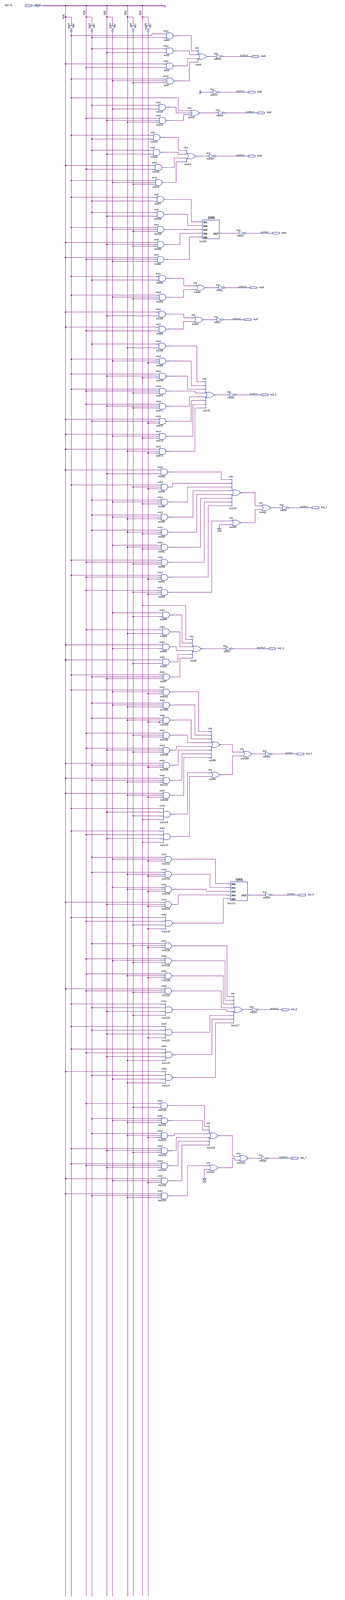
[diagram p0: schematic sheet, whole]
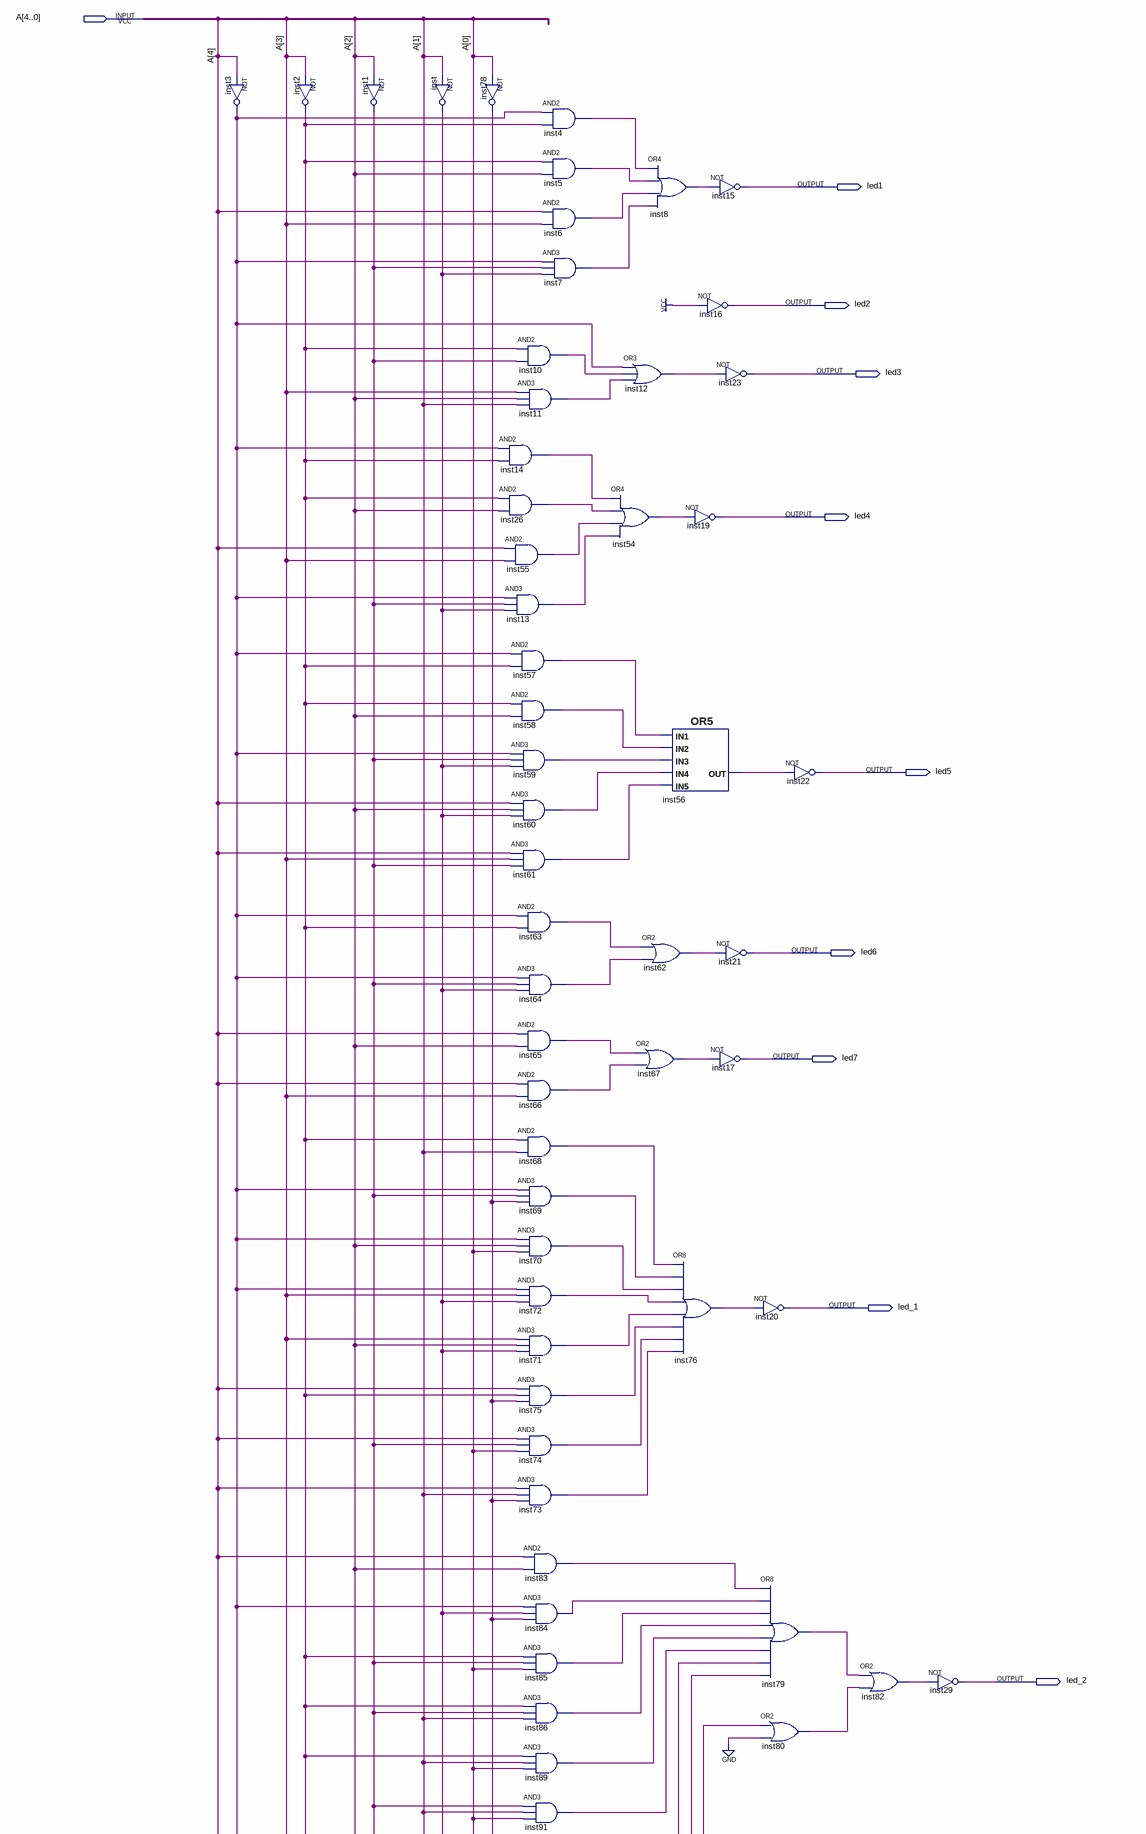
[diagram p1: schematic sheet, upper part]
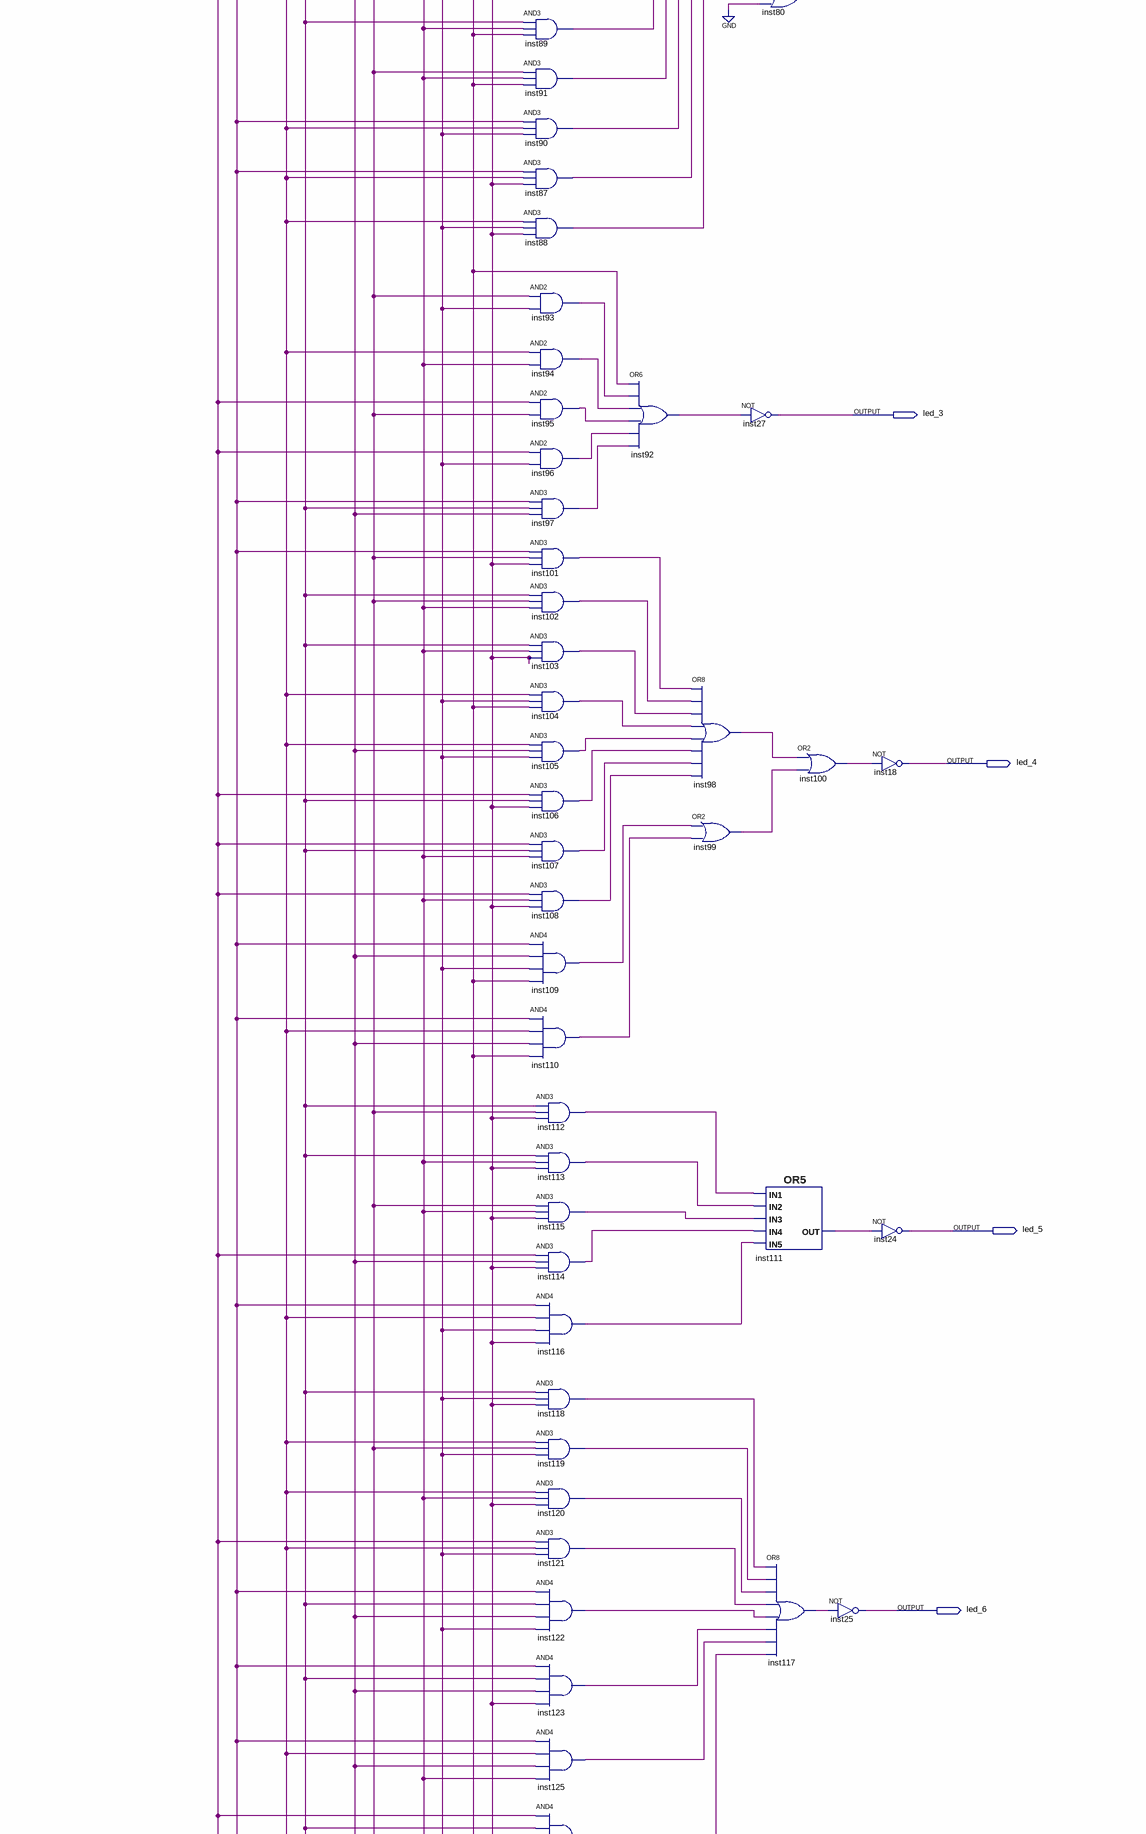
[diagram p2: schematic sheet, middle part]
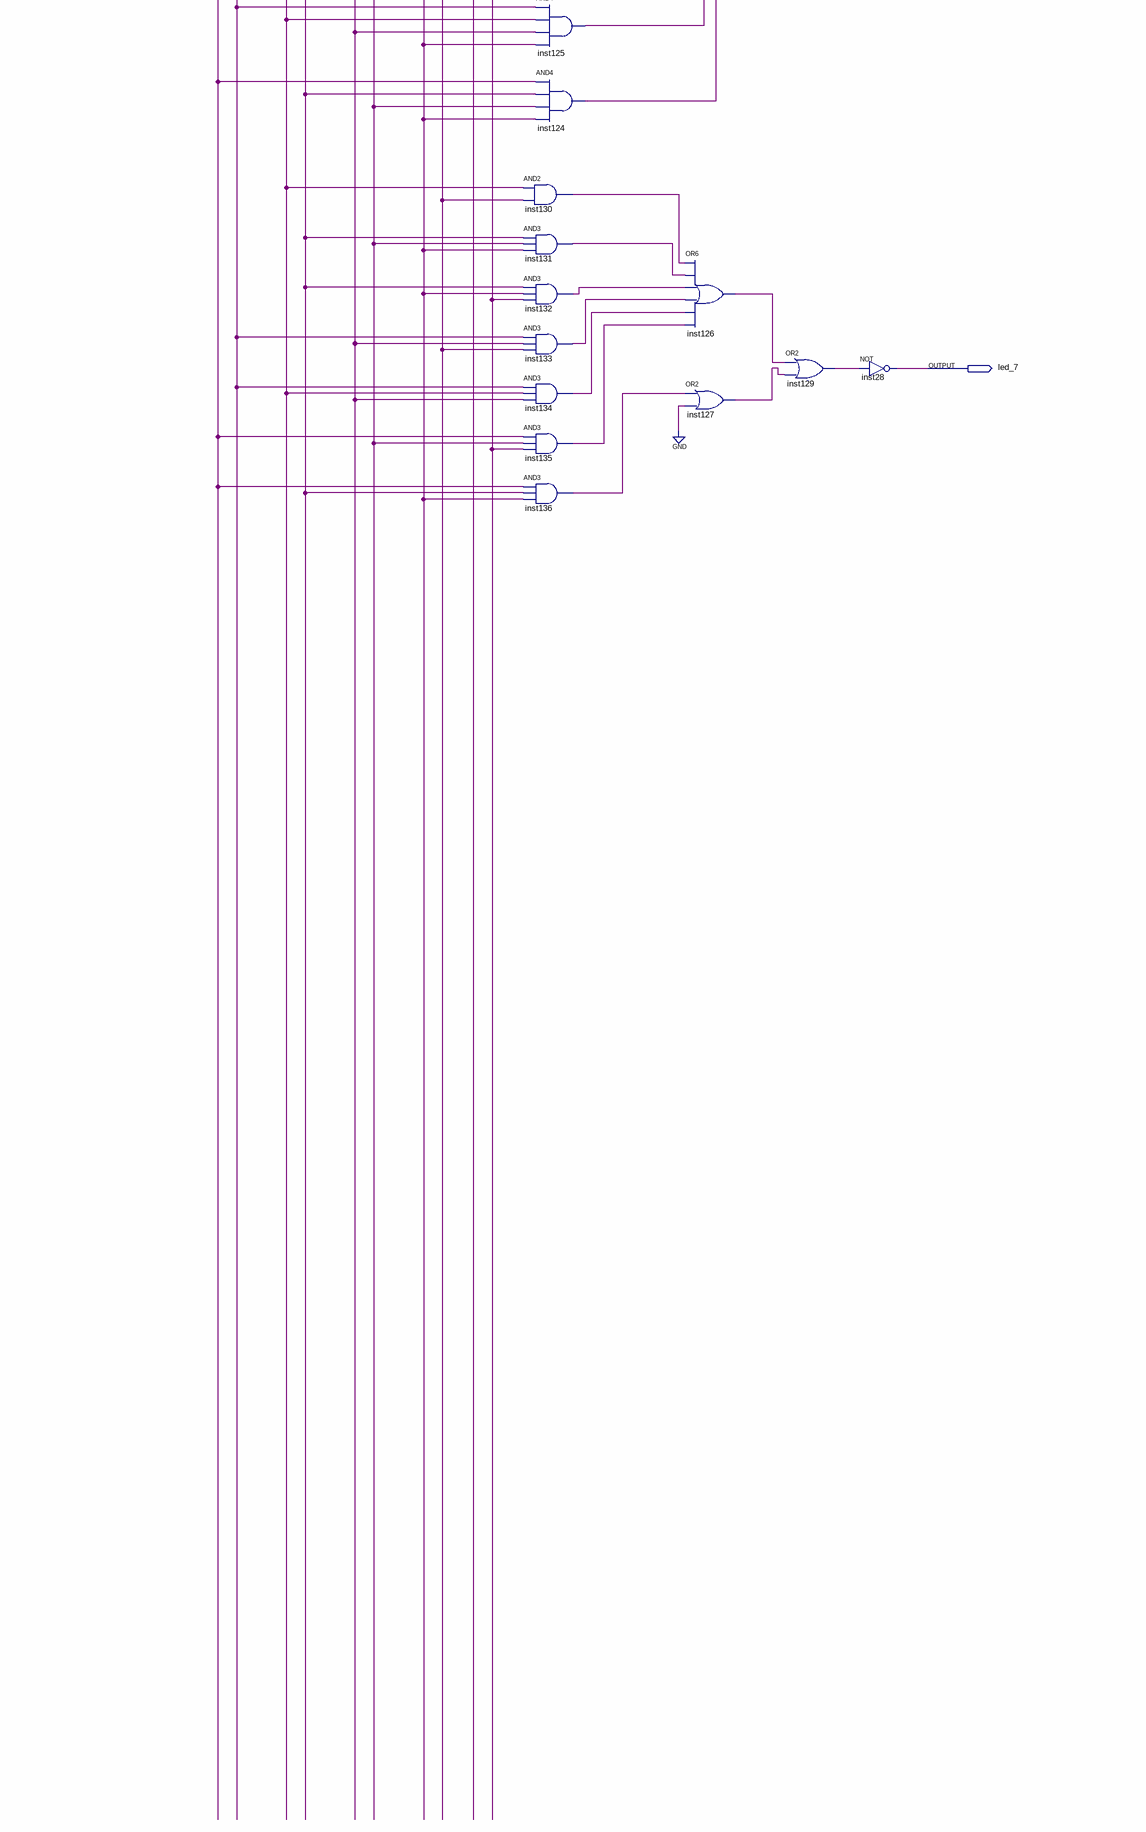
[diagram p3: schematic sheet, lower part]
// Quartus schematic decodificador5bits.bdf as structural Verilog: 109 symbols, 15 pins
module decodificador5bits (
  input  [4:0] A,
  output led1,
  output led2,
  output led3,
  output led4,
  output led5,
  output led6,
  output led7,
  output led_1,
  output led_2,
  output led_3,
  output led_4,
  output led_5,
  output led_6,
  output led_7
);

  wire inst1_out, inst2_out, inst3_out, inst4_out, inst5_out, inst6_out, inst7_out, inst8_out, inst10_out,
       inst11_out, inst12_out, inst13_out, inst14_out, inst26_out, inst54_out, inst55_out, inst56_out,
       inst57_out, inst58_out, inst59_out, inst60_out, inst61_out, inst62_out, inst63_out, inst64_out,
       inst65_out, inst66_out, inst67_out, inst68_out, inst69_out, inst70_out, inst71_out, inst72_out,
       inst73_out, inst74_out, inst75_out, inst76_out, inst78_out, inst79_out, inst80_out, inst82_out,
       inst83_out, inst84_out, inst85_out, inst86_out, inst87_out, inst88_out, inst89_out, inst90_out,
       inst91_out, inst92_out, inst93_out, inst94_out, inst95_out, inst96_out, inst97_out, inst98_out,
       inst99_out, inst100_out, inst101_out, inst102_out, inst103_out, inst104_out, inst105_out, inst106_out,
       inst107_out, inst108_out, inst109_out, inst110_out, inst111_out, inst112_out, inst113_out,
       inst114_out, inst115_out, inst116_out, inst117_out, inst118_out, inst119_out, inst120_out,
       inst121_out, inst122_out, inst123_out, inst124_out, inst125_out, inst126_out, inst127_out,
       inst129_out, inst130_out, inst131_out, inst132_out, inst133_out, inst134_out, inst135_out,
       inst136_out, inst_out;

  not inst3 (inst3_out, A[4]);
  not inst2 (inst2_out, A[3]);
  not inst1 (inst1_out, A[2]);
  not inst (inst_out, A[1]);
  not inst78 (inst78_out, A[0]);
  and inst14 (inst14_out, inst3_out, inst2_out);
  and inst26 (inst26_out, inst2_out, A[2]);
  and inst55 (inst55_out, A[4], A[3]);
  and inst13 (inst13_out, inst3_out, inst1_out, inst_out);
  and inst57 (inst57_out, inst3_out, inst2_out);
  and inst58 (inst58_out, inst2_out, A[2]);
  and inst59 (inst59_out, inst3_out, inst1_out, inst_out);
  and inst60 (inst60_out, A[4], A[2], inst_out);
  and inst61 (inst61_out, A[4], A[3], inst1_out);
  and inst4 (inst4_out, inst3_out, inst2_out);
  and inst5 (inst5_out, inst2_out, A[2]);
  and inst6 (inst6_out, A[4], A[3]);
  and inst7 (inst7_out, inst3_out, inst1_out, inst_out);
  and inst10 (inst10_out, inst2_out, inst1_out);
  and inst11 (inst11_out, A[3], A[2], A[1]);
  and inst63 (inst63_out, inst3_out, inst2_out);
  and inst64 (inst64_out, inst3_out, inst1_out, inst_out);
  and inst65 (inst65_out, A[4], A[2]);
  and inst66 (inst66_out, A[4], A[3]);
  and inst68 (inst68_out, inst2_out, A[1]);
  and inst69 (inst69_out, inst3_out, inst1_out, inst78_out);
  and inst70 (inst70_out, inst3_out, A[2], A[0]);
  and inst72 (inst72_out, inst3_out, A[3], inst_out);
  and inst71 (inst71_out, A[3], A[2], inst_out);
  and inst75 (inst75_out, A[4], inst2_out, inst78_out);
  and inst74 (inst74_out, A[4], inst1_out, A[0]);
  and inst73 (inst73_out, A[4], A[1], inst78_out);
  and inst83 (inst83_out, A[4], A[2]);
  and inst84 (inst84_out, inst3_out, inst_out, inst78_out);
  and inst85 (inst85_out, inst2_out, inst1_out, A[0]);
  and inst86 (inst86_out, inst2_out, inst1_out, A[1]);
  and inst89 (inst89_out, inst2_out, A[1], A[0]);
  and inst91 (inst91_out, inst1_out, A[1], A[0]);
  and inst90 (inst90_out, inst3_out, A[3], inst_out);
  and inst87 (inst87_out, inst3_out, A[3], inst78_out);
  and inst88 (inst88_out, A[3], inst_out, inst78_out);
  and inst93 (inst93_out, inst1_out, inst_out);
  and inst94 (inst94_out, A[3], A[1]);
  and inst95 (inst95_out, A[4], inst1_out);
  and inst96 (inst96_out, A[4], inst_out);
  and inst97 (inst97_out, inst3_out, inst2_out, A[2]);
  and inst101 (inst101_out, inst3_out, inst1_out, inst78_out);
  and inst102 (inst102_out, inst2_out, inst1_out, A[1]);
  and inst103 (inst103_out, inst2_out, A[1], inst78_out);
  and inst104 (inst104_out, A[3], inst_out, A[0]);
  and inst105 (inst105_out, A[3], A[2], inst_out);
  and inst106 (inst106_out, A[4], inst2_out, inst78_out);
  and inst107 (inst107_out, A[4], inst2_out, A[1]);
  and inst108 (inst108_out, A[4], A[1], inst78_out);
  and inst109 (inst109_out, inst3_out, A[2], inst_out, A[0]);
  and inst110 (inst110_out, inst3_out, A[3], A[2], A[0]);
  and inst112 (inst112_out, inst2_out, inst1_out, inst78_out);
  and inst113 (inst113_out, inst2_out, A[1], inst78_out);
  and inst115 (inst115_out, inst1_out, A[1], inst78_out);
  and inst114 (inst114_out, A[4], A[2], inst78_out);
  and inst116 (inst116_out, inst3_out, A[3], inst_out, inst78_out);
  and inst118 (inst118_out, inst2_out, inst_out, inst78_out);
  and inst119 (inst119_out, A[3], inst1_out, inst_out);
  and inst120 (inst120_out, A[3], A[1], inst78_out);
  and inst121 (inst121_out, A[4], A[3], inst_out);
  and inst122 (inst122_out, inst3_out, inst2_out, A[2], inst_out);
  and inst123 (inst123_out, inst3_out, inst2_out, A[2], inst78_out);
  and inst125 (inst125_out, inst3_out, A[3], A[2], A[1]);
  and inst124 (inst124_out, A[4], inst2_out, inst1_out, A[1]);
  and inst130 (inst130_out, A[3], inst_out);
  and inst131 (inst131_out, inst2_out, inst1_out, A[1]);
  and inst132 (inst132_out, inst2_out, A[1], inst78_out);
  and inst133 (inst133_out, inst3_out, A[2], inst_out);
  and inst134 (inst134_out, inst3_out, A[3], A[2]);
  and inst135 (inst135_out, A[4], inst1_out, inst78_out);
  and inst136 (inst136_out, A[4], inst2_out, A[1]);
  or inst54 (inst54_out, inst14_out, inst26_out, inst55_out, inst13_out);
  or inst8 (inst8_out, inst4_out, inst5_out, inst6_out, inst7_out);
  or inst12 (inst12_out, inst3_out, inst10_out, inst11_out);
  or inst56 (inst56_out, inst57_out, inst58_out, inst59_out, inst60_out, inst61_out);
  or inst62 (inst62_out, inst63_out, inst64_out);
  or inst67 (inst67_out, inst65_out, inst66_out);
  or inst92 (inst92_out, A[0], inst93_out, inst94_out, inst95_out, inst96_out, inst97_out);
  not inst15 (led1, inst8_out);
  not inst16 (led2, 1'b1);
  not inst19 (led4, inst54_out);
  not inst17 (led7, inst67_out);
  or inst76 (inst76_out, inst68_out, inst69_out, inst70_out, inst72_out, inst71_out, inst75_out, inst74_out, inst73_out);
  or inst98 (inst98_out, inst101_out, inst102_out, inst103_out, inst104_out, inst105_out, inst106_out, inst107_out, inst108_out);
  or inst99 (inst99_out, inst109_out, inst110_out);
  or inst126 (inst126_out, inst130_out, inst131_out, inst132_out, inst133_out, inst134_out, inst135_out);
  or inst127 (inst127_out, inst136_out, 1'b0);
  not inst23 (led3, inst12_out);
  not inst21 (led6, inst62_out);
  not inst20 (led_1, inst76_out);
  or inst79 (inst79_out, inst83_out, inst84_out, inst85_out, inst86_out, inst89_out, inst91_out, inst90_out, inst87_out);
  or inst80 (inst80_out, inst88_out, 1'b0);
  not inst27 (led_3, inst92_out);
  or inst111 (inst111_out, inst112_out, inst113_out, inst115_out, inst114_out, inst116_out);
  not inst22 (led5, inst56_out);
  or inst100 (inst100_out, inst98_out, inst99_out);
  or inst117 (inst117_out, inst118_out, inst119_out, inst120_out, inst121_out, inst122_out, inst123_out, inst125_out, inst124_out);
  or inst129 (inst129_out, inst126_out, inst127_out);
  or inst82 (inst82_out, inst79_out, inst80_out);
  not inst25 (led_6, inst117_out);
  not inst28 (led_7, inst129_out);
  not inst18 (led_4, inst100_out);
  not inst24 (led_5, inst111_out);
  not inst29 (led_2, inst82_out);
endmodule
